# EasyEDA Pro project 作业2.eprj

# Schematic Schematic1
Board Name: Board1; Create Date: 2025-07-04; Page Name: P1; Project Name: 作业2; Schematic Name: Schematic1; Update Date: 2025-07-04; Company: 嘉立创EDA; Page Size: A4; Version: V1.0
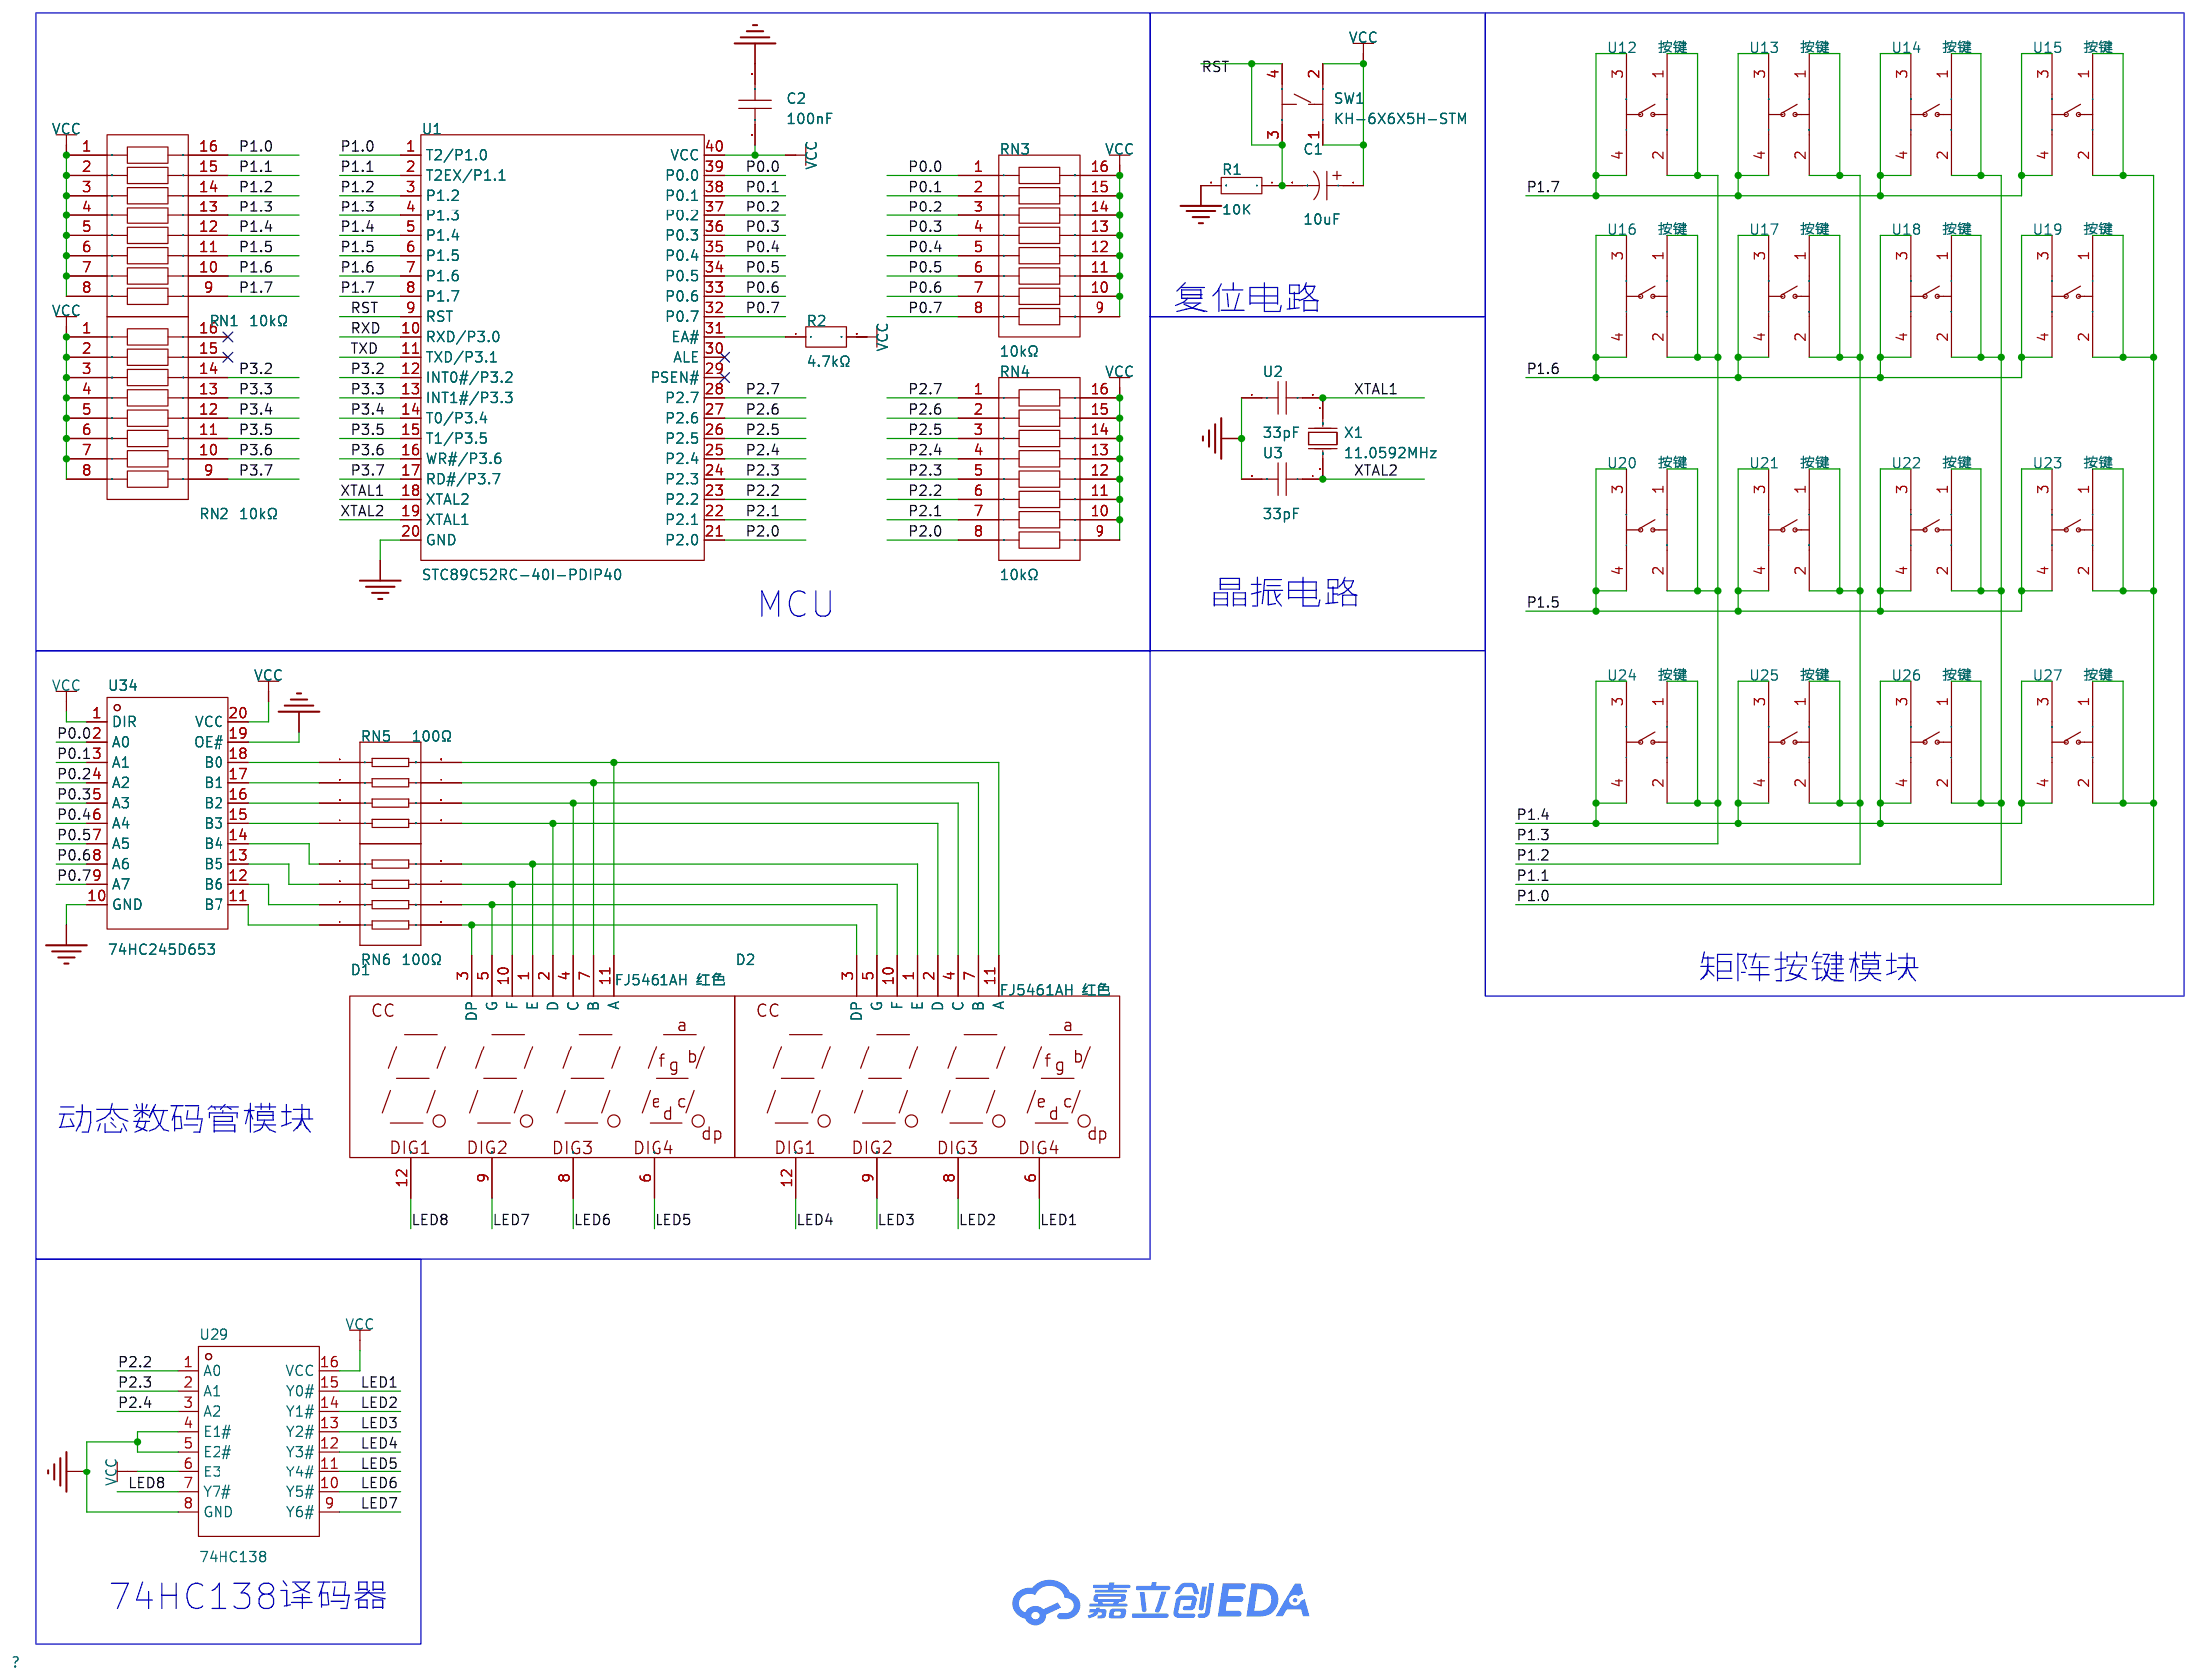
[diagram p0: schematic sheet]

## Parts
C1  10uF  [CAP-TH_BD10.0-P5.00-D0.6-FD_1]
C2  100nF  [C0603]
D1  FJ5461AH 红色  [LED-SEG-TH_FJ5461AH]
D2  FJ5461AH 红色  [LED-SEG-TH_FJ5461AH]
R1  10K  [R0603]
R2  4.7kΩ  [R0805]
RN1  10kΩ  [DIP-16_L22.0-W6.7-P2.54-LS7.6-BL]
RN2  10kΩ  [DIP-16_L22.0-W6.7-P2.54-LS7.6-BL]
RN3  10kΩ  [DIP-16_L22.0-W6.7-P2.54-LS7.6-BL]
RN4  10kΩ  [DIP-16_L22.0-W6.7-P2.54-LS7.6-BL]
RN5  100Ω  [RES-ARRAY-SMD_0402-8P-L2.0-W1.0-BL]
RN6  100Ω  [RES-ARRAY-SMD_0402-8P-L2.0-W1.0-BL]
SW1  KH-6X6X5H-STM  [SW-SMD_4P-L6.0-W6.0-P4.50-LS9.0_H5.0]
U1  STC89C52RC-40I-PDIP40  [DIP-40_L52.0-W13.7-P2.54-LS15.2-BL]
U2  33pF  [C0603]
U3  33pF  [C0603]
U12  按键  [SW-SMD_4P-L6.0-W6.0-P4.50-LS9.0-2]
U13  按键  [SW-SMD_4P-L6.0-W6.0-P4.50-LS9.0-2]
U14  按键  [SW-SMD_4P-L6.0-W6.0-P4.50-LS9.0-2]
U15  按键  [SW-SMD_4P-L6.0-W6.0-P4.50-LS9.0-2]
U16  按键  [SW-SMD_4P-L6.0-W6.0-P4.50-LS9.0-2]
U17  按键  [SW-SMD_4P-L6.0-W6.0-P4.50-LS9.0-2]
U18  按键  [SW-SMD_4P-L6.0-W6.0-P4.50-LS9.0-2]
U19  按键  [SW-SMD_4P-L6.0-W6.0-P4.50-LS9.0-2]
U20  按键  [SW-SMD_4P-L6.0-W6.0-P4.50-LS9.0-2]
U21  按键  [SW-SMD_4P-L6.0-W6.0-P4.50-LS9.0-2]
U22  按键  [SW-SMD_4P-L6.0-W6.0-P4.50-LS9.0-2]
U23  按键  [SW-SMD_4P-L6.0-W6.0-P4.50-LS9.0-2]
U24  按键  [SW-SMD_4P-L6.0-W6.0-P4.50-LS9.0-2]
U25  按键  [SW-SMD_4P-L6.0-W6.0-P4.50-LS9.0-2]
U26  按键  [SW-SMD_4P-L6.0-W6.0-P4.50-LS9.0-2]
U27  按键  [SW-SMD_4P-L6.0-W6.0-P4.50-LS9.0-2]
U29  74HC138  [SOIC-16_L9.9-W3.9-P1.27-LS6.0-BL]
U34  74HC245D653  [SOIC-20_L13.0-W7.6-P1.27-LS10.3-BL]
X1  11.0592MHz  [HC-49US_L11.5-W4.5-P4.88]

## Library data of the parts
C1 = CV100MPA16B: 容值:10uF;精度:±20%;额定电压:450V;纹波电流:200mA@100kHz;等效串联电阻(ESR):9Ω@100kHz;; LCSC Part Name: 10uF ±20% 450V; Supplier Part: C911241; Manufacturer: TWBOR(伯鸿); Supplier Footprint: 插件,D10xL16mm; JLCPCB Part Class: 扩展库; Datasheet: https://atta.szlcsc.com/upload/public/pdf/source/20201117/C911241_08C53D140102C9DE5D4425A5E1B3FE4F.pdf; Supplier: LCSC; Tolerance: ±20%; Voltage Rating: 450V; Ripple Current: 200mA@100kHz; Equivalent Series Resistance(ESR): 9Ω@100kHz; Pin Spacing: 5mm; Diameter: 10mm; Height - Seated (Max): 16mm; Lifetime: 5000hrs@105℃; Operating Temperature: -25℃~+105℃
C2 = 0603X7R104K250NT: 容值:100nF;精度:±10%;额定电压:25V;温度系数:X7R;; LCSC Part Name: 100nF ±10% 25V; Supplier Part: C48579280; Manufacturer: AIDE(爱迪电容); Supplier Footprint: 0603; JLCPCB Part Class: 扩展库; Datasheet: https://atta.szlcsc.com/upload/public/pdf/source/20210330/C2691711_5D01E1D4D7BF54205139C8425089DFE9.pdf; Supplier: LCSC; Tolerance: ±10%; Voltage Rating: 25V; Temperature Coefficient: X7R
D1 D2 = FJ5461AH 红色: 数码管位数:4位;功耗:-;发光颜色:红色;LED极性:共阴极;数字/字母大小(英寸):0.56;; LCSC Part Name: 4位0.56英寸红色数码管 共阴极; Supplier Part: C54396; Manufacturer: 志浩; Supplier Footprint: 插件; JLCPCB Part Class: 扩展库; Datasheet: https://atta.szlcsc.com/upload/public/pdf/source/20151111/1457707576636.pdf; Supplier: LCSC; Number of Characters: 4位; Display Type: 7段; Luminous Color: 红色; LED Polarity: 共阴极; Digit/Alpha Size(inch): 0.56
R1 = Res_0603: Supplier Footprint: 0603
R2 = ERJ-U06F4701V: 电阻类型:厚膜电阻;阻值:4.7kΩ;精度:±1%;功率:125mW;工作电压:-;温度系数:±100ppm/℃;; LCSC Part Name: 4.7kΩ ±1% 125mW 厚膜电阻; Supplier Part: C1859462; Manufacturer: PANASONIC(松下); Supplier Footprint: 0805; JLCPCB Part Class: 扩展库; Datasheet: https://atta.szlcsc.com/upload/public/pdf/source/20210624/C1859462_0DC8A541405FCF91B34CFE3F505433C6.pdf; Supplier: LCSC; Type: 厚膜电阻; Tolerance: ±1%; Power(Watts): 125mW; Temperature Coefficient: ±100ppm/℃; Operating Temperature: -55℃~+155℃
RN1-RN4 = 4116R-1-103LF: 电阻器数:8;阻值:10kΩ;精度:±2%;单个元件功率:250mW;温度系数:±100ppm/℃;; LCSC Part Name: 10kΩ ±2%; Supplier Part: C6087381; Manufacturer: BOURNS; Supplier Footprint: DIP-16; Datasheet: https://atta.szlcsc.com/upload/public/pdf/source/20210630/3D9C012B231BA1D1C9C6139B97130D1A.pdf; Supplier: LCSC; Number of Resistors: 8; Tolerance: ±2%; Power(Watts): 250mW; Temperature Coefficient: ±100ppm/℃; Number of Pins: 16
RN5 RN6 = 4D02WGJ0101TCE: 电阻器数:4;阻值:100Ω;精度:±5%;单个元件功率:62.5mW;温度系数:±200ppm/℃;; LCSC Part Name: 100Ω ±5%; Supplier Part: C48442; Manufacturer: UNI-ROYAL(厚声); Supplier Footprint: 0402x4; JLCPCB Part Class: 扩展库; Datasheet: https://atta.szlcsc.com/upload/public/pdf/source/20191224/C474318_2527498AE30E813171187CCD28401A71.pdf; Supplier: LCSC; Number of Resistors: 4; Tolerance: ±5%; Power(Watts): 62.5mW; Temperature Coefficient: ±200ppm/℃; Number of Pins: 8
SW1 = KH-6X6X5H-STM: 电路结构:单刀单掷;按钮形状:圆形按钮;安装方式:立贴;开关长度:6mm;开关宽度:6mm;开关高度:5mm;带支架:不带;触点电流:50mA;额定电压(DC):12V;机械寿命:8万次;; LCSC Part Name: 6*6*5mm 立贴 轻触开关; Supplier Part: C2837531; Manufacturer: kinghelm(金航标); Supplier Footprint: SMD; JLCPCB Part Class: 扩展库; Datasheet: https://atta.szlcsc.com/upload/public/pdf/source/20210608/C2837531_45E87AB996CE723B09405FF2EA209C4C.pdf; Supplier: LCSC; Circuit: 单刀单掷; Actuator Style: 圆形按钮; Mounting Style: 立贴; Switch Length: 6mm; Switch Width: 6mm; Switch Height: 5mm; Strike Gundam: 不带; Contact Current: 50mA; Voltage Rating (DC): 12V; Actuator/Cap Color: 黑色; Pin Style: 鸥翼型; Mechanical Life: 8万次
U1 = STC89C52RC-40I-PDIP40: CPU内核:51系列;应用领域:-;; Supplier Part: C14022; Manufacturer: STC; Supplier Footprint: DIP-40; JLCPCB Part Class: 扩展库; Datasheet: https://atta.szlcsc.com/upload/public/pdf/source/20250219/C2F0DDDE7C5E9ADA5B33742D18630F09.pdf; Supplier: LCSC; CPU Core: 51系列; Program Storage Size: 8KB; Program Memory Type: FLASH; Number of I/O: 35; Voltage - Supply: 3.3V~5.5V
U2 U3 = GRM1885C1H330FA01D: 容值:33pF;精度:±1%;额定电压:50V;温度系数:-;; LCSC Part Name: 33pF ±1% 50V; Supplier Part: C882522; Manufacturer: muRata(村田); Supplier Footprint: 0603; JLCPCB Part Class: 扩展库; Datasheet: https://atta.szlcsc.com/upload/public/pdf/source/20200305/C490387_23319AE8C154DEB24C505E6C82A8106A.pdf; Supplier: LCSC; Tolerance: ±1%; Voltage Rating: 50V
U12-U27 = 按键: Supplier Part: C9900024939; Supplier Footprint: SW-SMD; JLCPCB Part Class: 扩展库; Supplier: LCSC
U29 = 74HC138: 三八译码器，74系列逻辑芯片,2.0V-6.0V供电电压。; LCSC Part Name: 停产; Supplier Part: C86611; Manufacturer: FM(富满); Supplier Footprint: SOIC-16; JLCPCB Part Class: 扩展库; Datasheet: https://atta.szlcsc.com/upload/public/pdf/source/20170103/1483435332227.pdf; Supplier: LCSC
U34 = 74HC245D653: Supplier Part: C70245; Supplier Footprint: SOIC-20-300mil; JLCPCB Part Class: 扩展库; Supplier: LCSC
X1 = X49SD110592MSD2SC: 晶振类型:直插晶振;频率:11.0592MHz;常温频差:±20ppm;负载电容:20pF;频率稳定度:±30ppm;; LCSC Part Name: HC-49US 11.0592MHZ 2P 49S 20PF ±20PPM -20~70℃（±30PPM）; Supplier Part: C2203; Manufacturer: YXC(扬兴晶振); Supplier Footprint: HC-49S; JLCPCB Part Class: 扩展库; Datasheet: https://atta.szlcsc.com/upload/public/pdf/source/20240329/977D7F2434F98B2BE33270BB9FF3D86D.pdf; Supplier: LCSC; Type: 直插晶振; Normal temperature Frequency Tolerance: ±20ppm; Load Capacitance: 20pF; Frequency Stability: ±30ppm; Operating Temperature: -20℃~+70℃

## Nets
GND: C2.2 R1.2 U1.20(GND) U2.1 U3.2 U29.4(E1#) U29.5(E2#) U29.8(GND) U34.10(GND) U34.19(OE#)
VCC: C1.1 C2.1 R2.2 RN1.1 RN1.2 RN1.3 RN1.4 RN1.5 RN1.6 RN1.7 RN1.8 RN2.1 RN2.2 RN2.3 RN2.4 RN2.5 RN2.6 RN2.7 RN2.8 RN3.9 RN3.10 RN3.11 RN3.12 RN3.13 RN3.14 RN3.15 RN3.16 RN4.9 RN4.10 RN4.11 RN4.12 RN4.13 RN4.14 RN4.15 RN4.16 SW1.1 SW1.2 U1.40(VCC) U29.6(E3) U29.16(VCC) U34.1(DIR) U34.20(VCC)
LED1: D2.6(DIG4) U29.15(Y0#)
LED2: D2.8(DIG3) U29.14(Y1#)
LED3: D2.9(DIG2) U29.13(Y2#)
LED4: D2.12(DIG1) U29.12(Y3#)
LED5: D1.6(DIG4) U29.11(Y4#)
LED6: D1.8(DIG3) U29.10(Y5#)
LED7: D1.9(DIG2) U29.9(Y6#)
LED8: D1.12(DIG1) U29.7(Y7#)
P0.0: RN3.1 U1.39(P0.0) U34.2(A0)
P0.1: RN3.2 U1.38(P0.1) U34.3(A1)
P0.2: RN3.3 U1.37(P0.2) U34.4(A2)
P0.3: RN3.4 U1.36(P0.3) U34.5(A3)
P0.4: RN3.5 U1.35(P0.4) U34.6(A4)
P0.5: RN3.6 U1.34(P0.5) U34.7(A5)
P0.6: RN3.7 U1.33(P0.6) U34.8(A6)
P0.7: RN3.8 U1.32(P0.7) U34.9(A7)
P1.0: RN1.16 U1.1(T2/P1.0) U15.1 U15.2 U19.1 U19.2 U23.1 U23.2 U27.1 U27.2
P1.1: RN1.15 U1.2(T2EX/P1.1) U14.1 U14.2 U18.1 U18.2 U22.1 U22.2 U26.1 U26.2
P1.2: RN1.14 U1.3(P1.2) U13.1 U13.2 U17.1 U17.2 U21.1 U21.2 U25.1 U25.2
P1.3: RN1.13 U1.4(P1.3) U12.1 U12.2 U16.1 U16.2 U20.1 U20.2 U24.1 U24.2
P1.4: RN1.12 U1.5(P1.4) U24.3 U24.4 U25.3 U25.4 U26.3 U26.4 U27.3 U27.4
P1.5: RN1.11 U1.6(P1.5) U20.3 U20.4 U21.3 U21.4 U22.3 U22.4 U23.3 U23.4
P1.6: RN1.10 U1.7(P1.6) U16.3 U16.4 U17.3 U17.4 U18.3 U18.4 U19.3 U19.4
P1.7: RN1.9 U1.8(P1.7) U12.3 U12.4 U13.3 U13.4 U14.3 U14.4 U15.3 U15.4
P2.0: RN4.8 U1.21(P2.0)
P2.1: RN4.7 U1.22(P2.1)
P2.2: RN4.6 U1.23(P2.2) U29.1(A0)
P2.3: RN4.5 U1.24(P2.3) U29.2(A1)
P2.4: RN4.4 U1.25(P2.4) U29.3(A2)
P2.5: RN4.3 U1.26(P2.5)
P2.6: RN4.2 U1.27(P2.6)
P2.7: RN4.1 U1.28(P2.7)
P3.2: RN2.14 U1.12(INT0#/P3.2)
P3.3: RN2.13 U1.13(INT1#/P3.3)
P3.4: RN2.12 U1.14(T0/P3.4)
P3.5: RN2.11 U1.15(T1/P3.5)
P3.6: RN2.10 U1.16(WR#/P3.6)
P3.7: RN2.9 U1.17(RD#/P3.7)
RST: C1.2 R1.1 SW1.3 SW1.4 U1.9(RST)
RXD: U1.10(RXD/P3.0)
TXD: U1.11(TXD/P3.1)
XTAL1: U1.18(XTAL2) U2.2 X1.1(OSC1)
XTAL2: U1.19(XTAL1) U3.1 X1.2(OSC2)
$1N691: R2.1 U1.31(EA#)
$1N1499: RN5.1 U34.18(B0)
$1N1500: RN5.2 U34.17(B1)
$1N1501: RN5.3 U34.16(B2)
$1N1502: RN5.4 U34.15(B3)
$1N1503: RN6.1 U34.14(B4)
$1N1504: RN6.2 U34.13(B5)
$1N1505: RN6.3 U34.12(B6)
$1N1506: RN6.4 U34.11(B7)
$1N1507: D1.11(A) D2.11(A) RN5.8
$1N1508: D1.7(B) D2.7(B) RN5.7
$1N1509: D1.4(C) D2.4(C) RN5.6
$1N1510: D1.2(D) D2.2(D) RN5.5
$1N1511: D1.1(E) D2.1(E) RN6.8
$1N1512: D1.10(F) D2.10(F) RN6.7
$1N1513: D1.5(G) D2.5(G) RN6.6
$1N1514: D1.3(DP) D2.3(DP) RN6.5

Not connected (* = marked no-connect by the designer): RN2 15* 16*; U1 29(PSEN#)* 30(ALE)*

## Notes on the sheet
- 复位电路
- MCU
- 晶振电路
- 矩阵按键模块
- 动态数码管模块
- 74HC138译码器

# Board PCB1
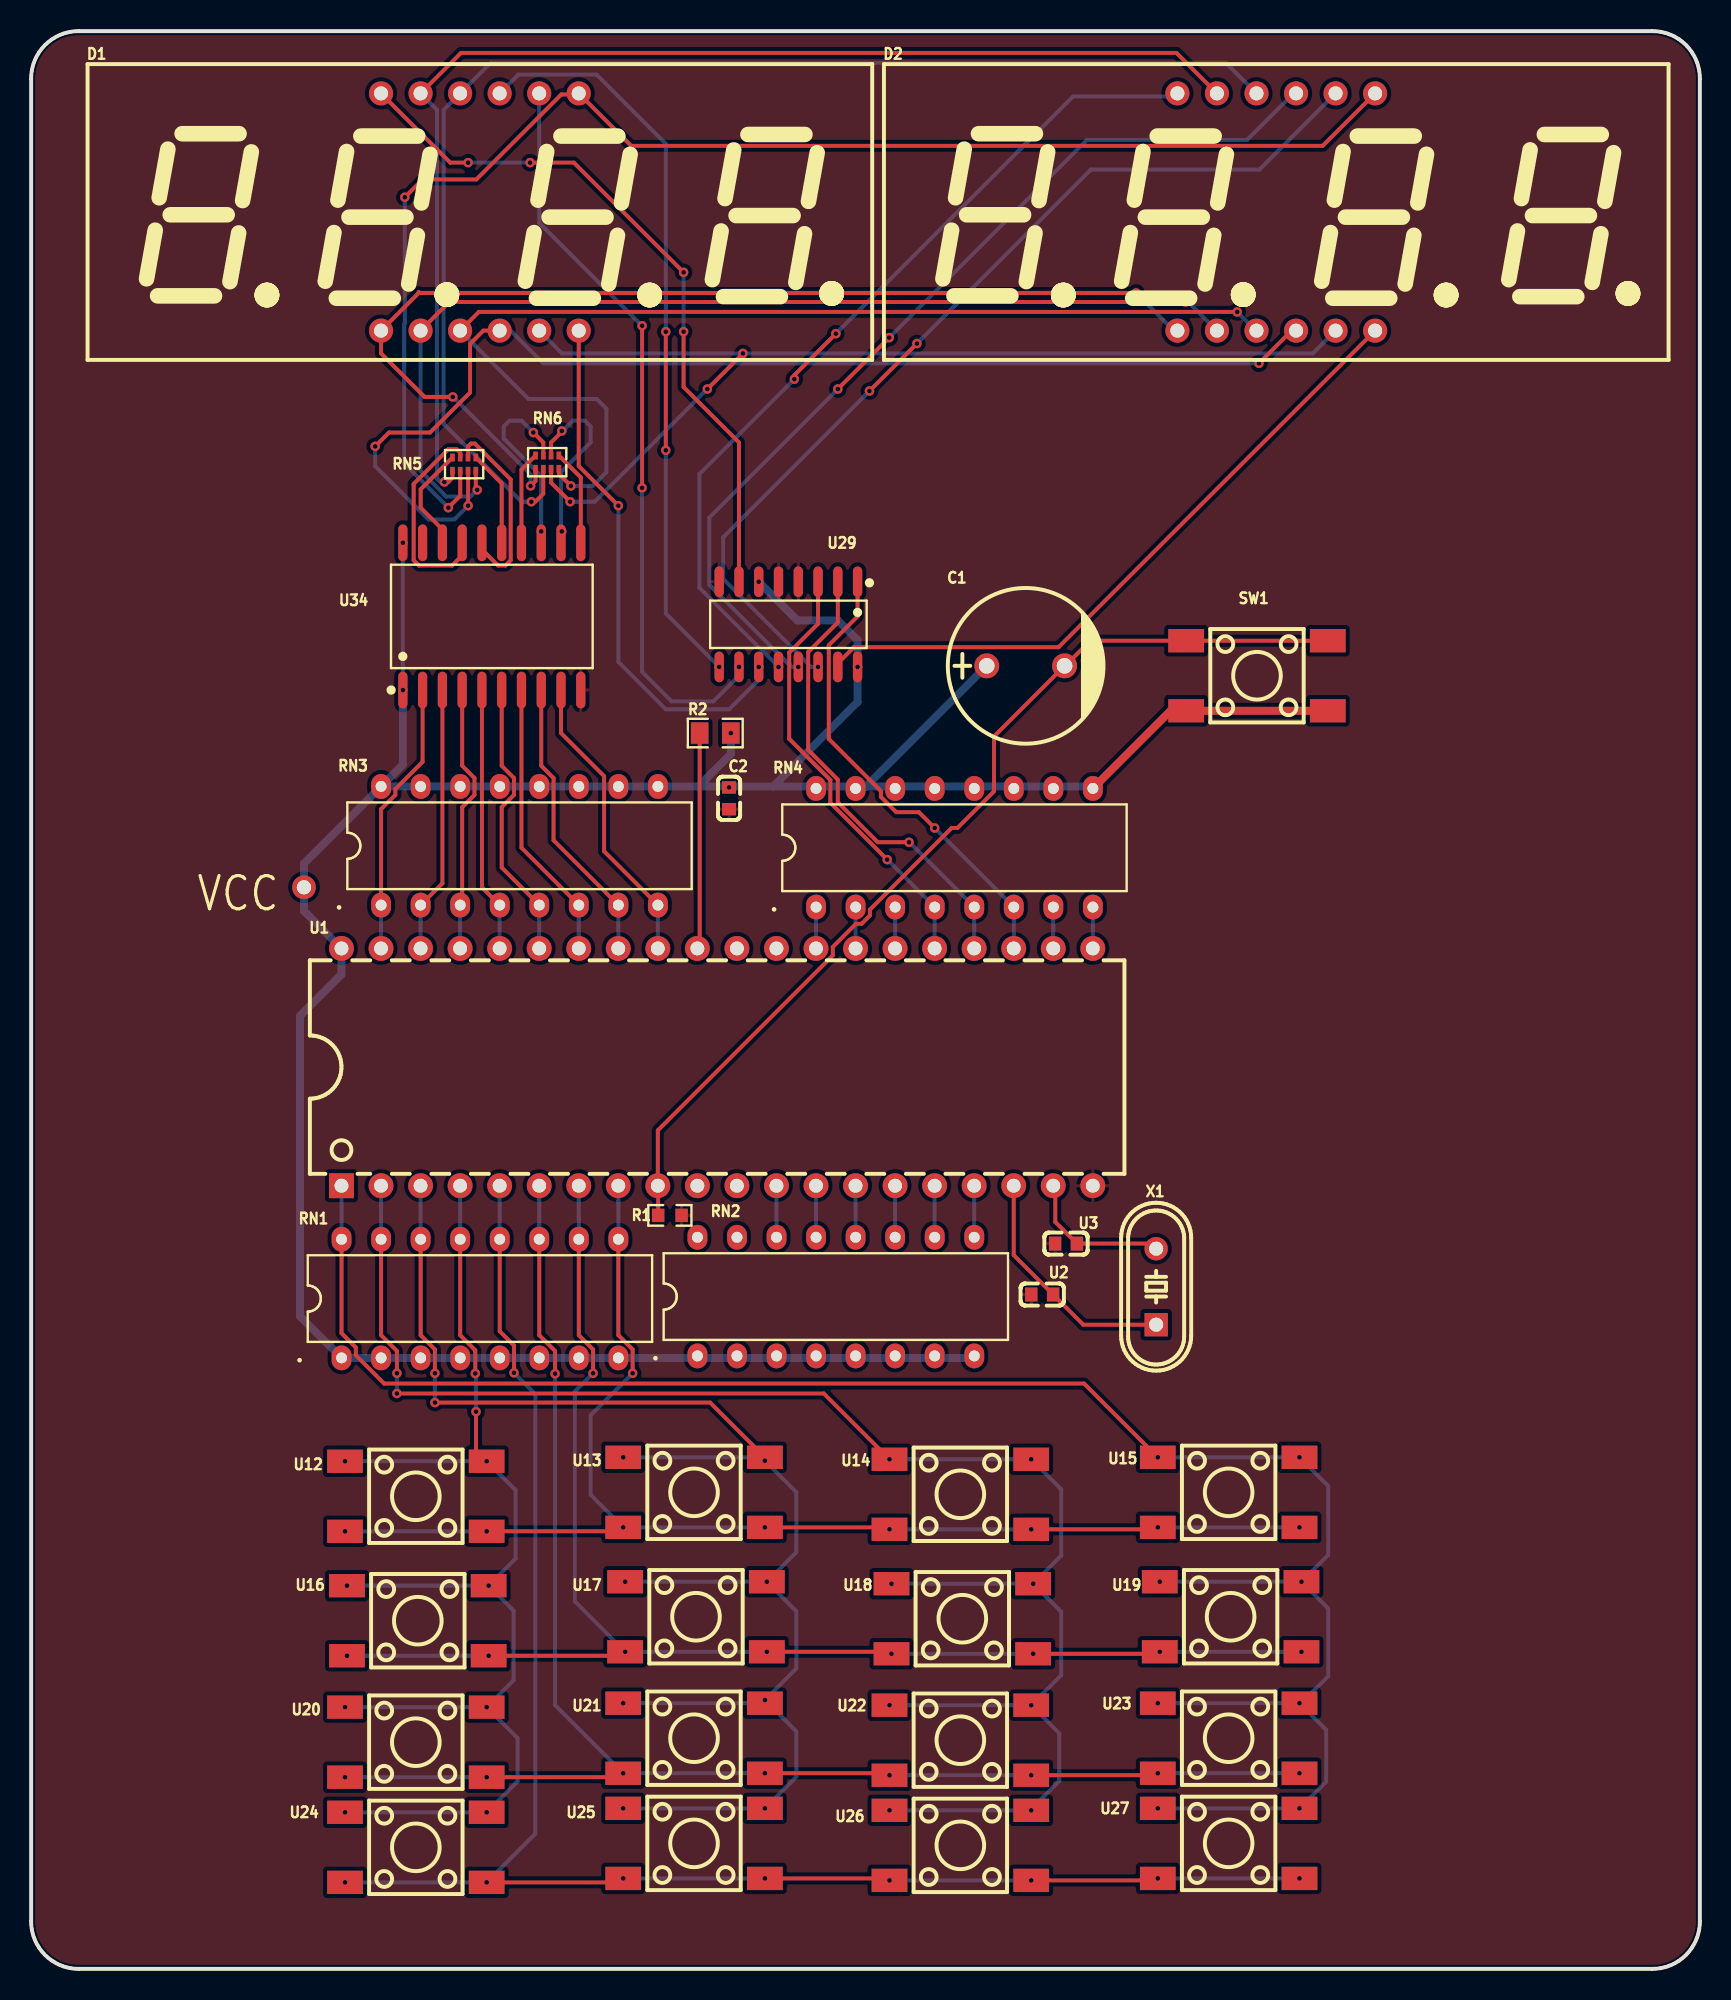
[diagram p1: board, top side]
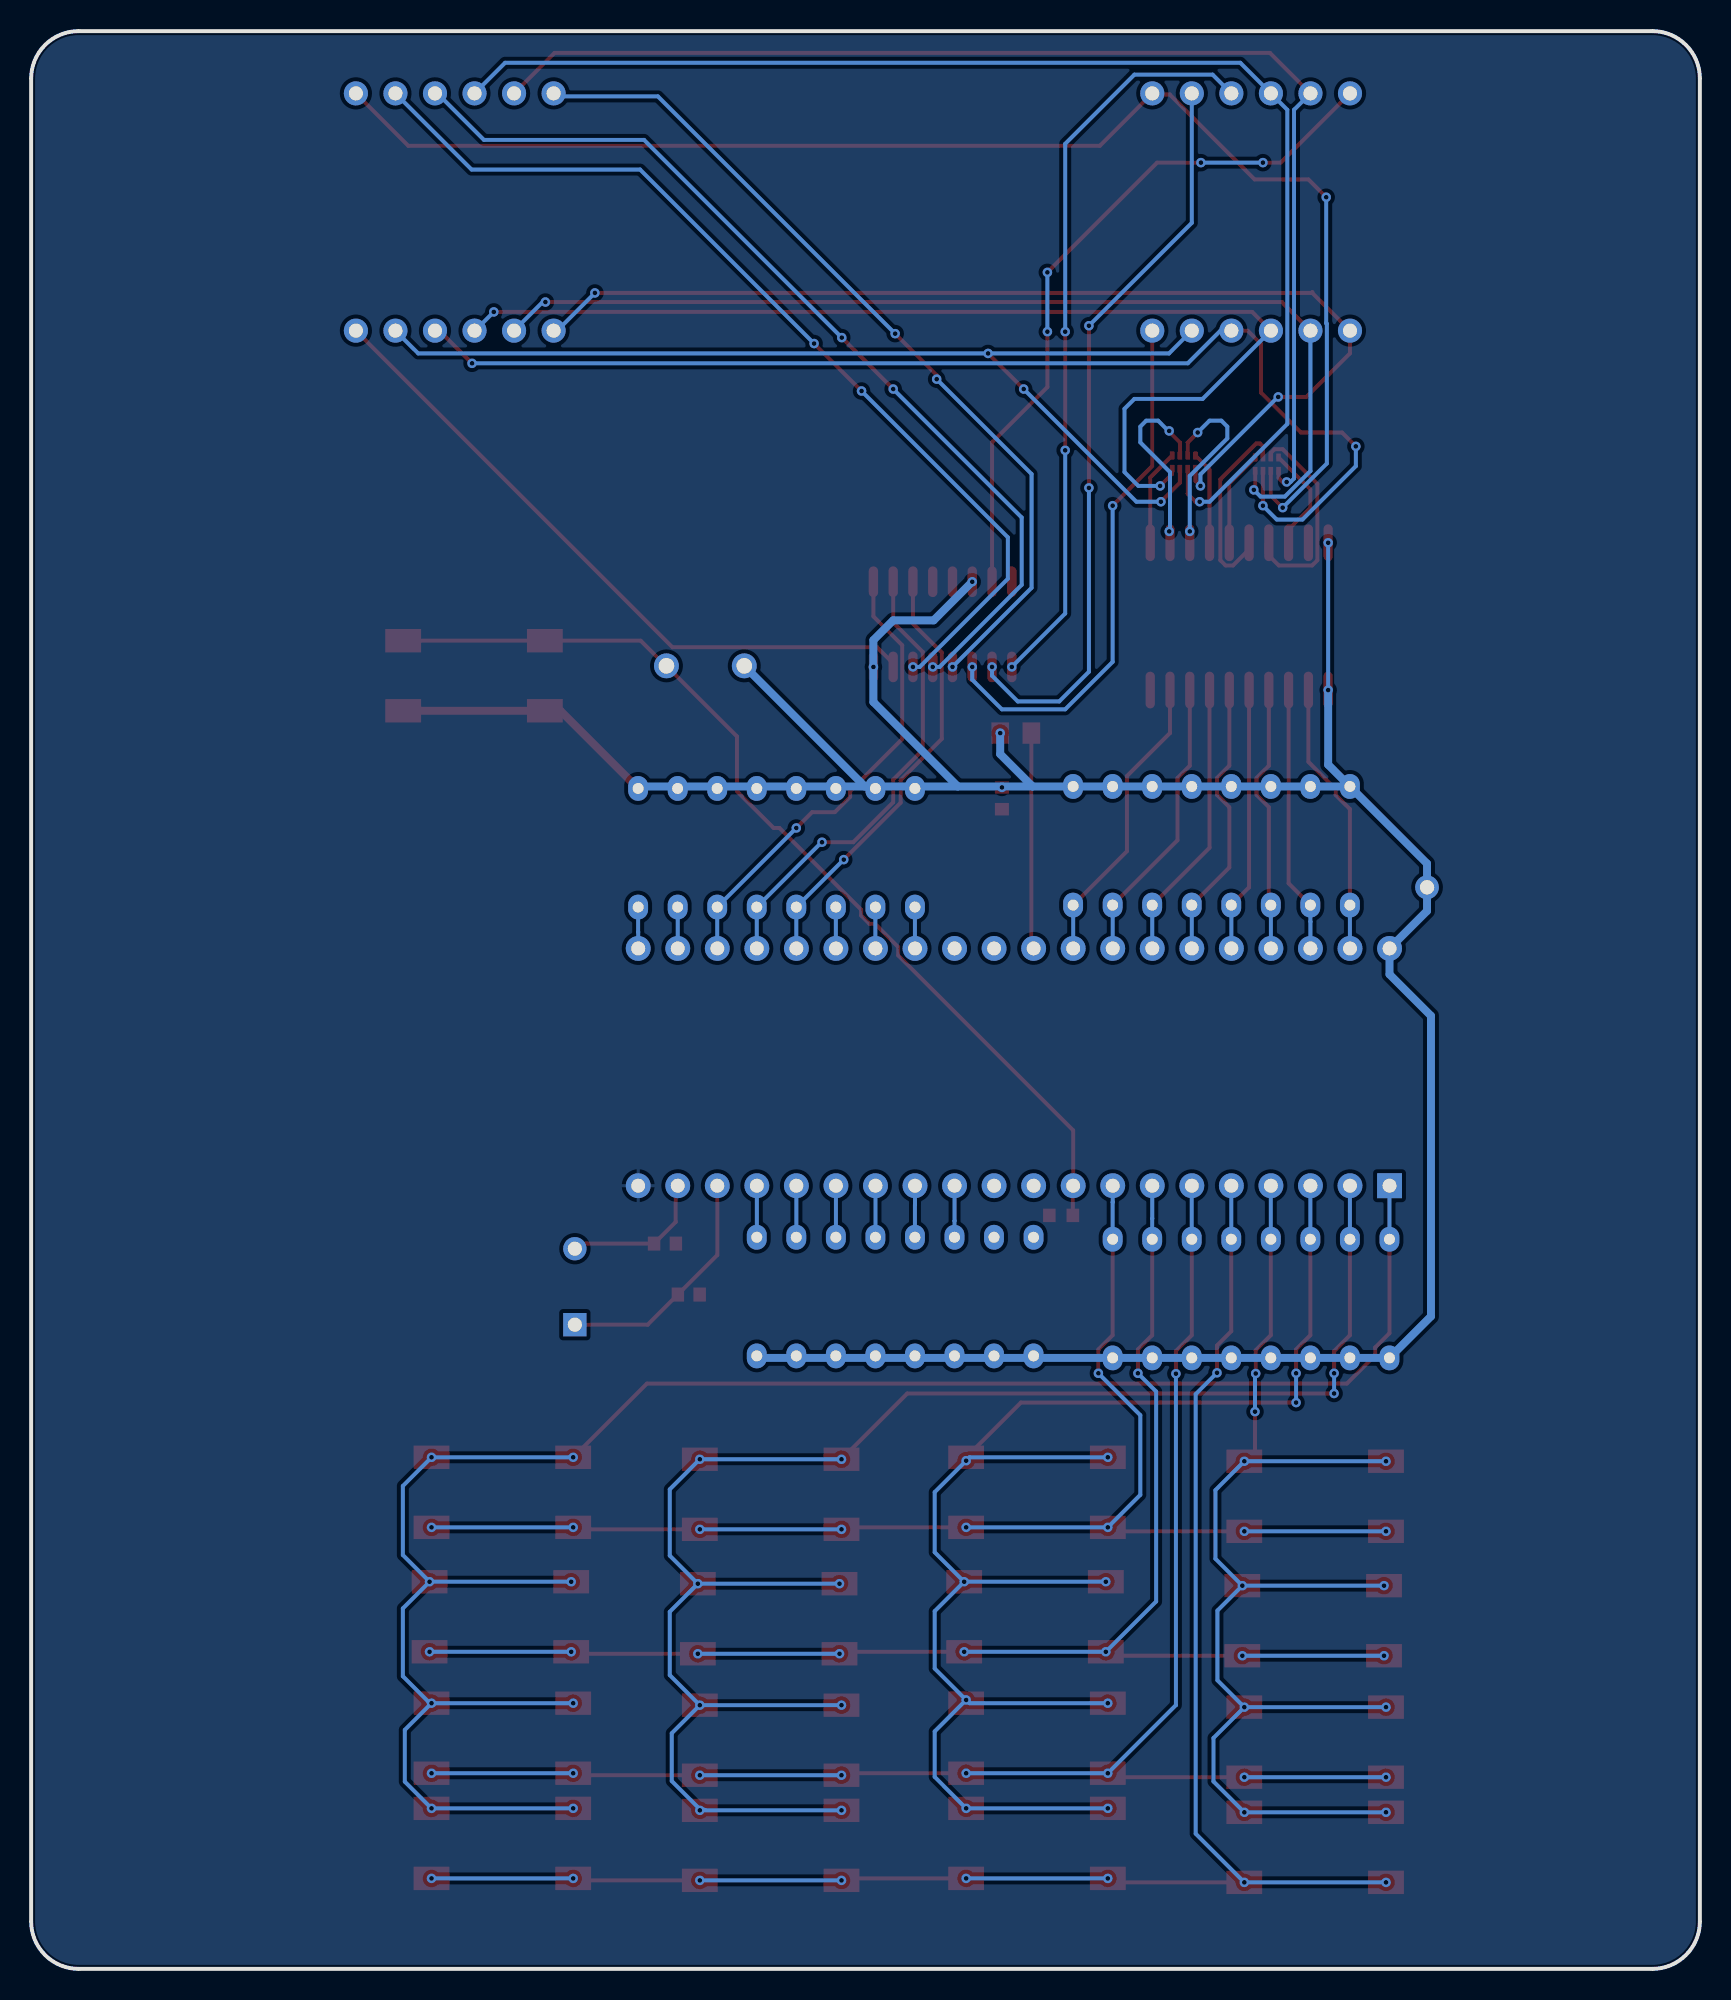
[diagram p2: board, bottom side, seen from below]

Outline 107.19 x 124.46 mm; copper layers: Top Layer, Bottom Layer. Coordinates in mm from the lower left corner of the outline.
Outline path: 0,121.41 0,3.05 arc(0.89,0.89) 3.05,0 104.14,0 arc(106.3,0.89) 107.19,3.05 107.19,121.41 arc(106.3,123.57) 104.14,124.46 3.05,124.46 arc(0.89,123.57) 0,121.41
Stack: Top Layer 0.035mm / Dielectric1 1.51mm FR4 er 4.5 / Bottom Layer 0.035mm

## Design rules (mm)
template: JLCPCB Capability(Two Layers Board)
spacing copperThickness1oz (default): track to track 0.102, other pairs 0.152 to 0.3
spacing copperThickness2oz: track to track 0.203, other pairs 0.152 to 0.3
track width copperThickness1oz (default): min 0.127, default 0.254, max 2.54
track width copperThickness2oz: min 0.203, default 0.254, max 2.54
differential pair differentialPair (default): width min 0.127, default 0.254, max 2.54; gap min 0.152, default 0.152
via viaSize (default): diameter min 0.5, default 0.61, max 10; hole min 0.3, default 0.305, max 6.3

## Placement (name value [footprint] x y rotation side)
C1  10uF  [CAP-TH_BD10.0-P5.00-D0.6-FD_1]  63.88 83.69 0 top
C2  100nF  [C0603]  44.83 75.18 270 top
D1  FJ5461AH 红色  [LED-SEG-TH_FJ5461AH]  28.82 112.84 0 top
D2  FJ5461AH 红色  [LED-SEG-TH_FJ5461AH]  79.98 112.84 0 top
NOREF  -  [Pad_e132]  17.53 69.47 0 top
R1  10K  [R0603]  41.03 48.4 0 top
R2  4.7kΩ  [R0805]  43.94 79.37 0 top
RN1  10kΩ  [DIP-16_L22.0-W6.7-P2.54-LS7.6-BL]  28.83 43.05 0 top
RN2  10kΩ  [DIP-16_L22.0-W6.7-P2.54-LS7.6-BL]  51.69 43.18 0 top
RN3  10kΩ  [DIP-16_L22.0-W6.7-P2.54-LS7.6-BL]  31.37 72.14 0 top
RN4  10kΩ  [DIP-16_L22.0-W6.7-P2.54-LS7.6-BL]  59.31 72.01 0 top
RN5  100Ω  [RES-ARRAY-SMD_0402-8P-L2.0-W1.0-BL]  27.81 96.65 0 top
RN6  100Ω  [RES-ARRAY-SMD_0402-8P-L2.0-W1.0-BL]  33.15 96.77 0 top
SW1  KH-6X6X5H-STM  [SW-SMD_4P-L6.0-W6.0-P4.50-LS9.0_H5.0]  78.74 83.06 180 top
U1  STC89C52RC-40I-PDIP40  [DIP-40_L52.0-W13.7-P2.54-LS15.2-BL]  44.06 57.92 0 top
U2  33pF  [C0603]  64.95 43.31 0 top
U3  33pF  [C0603]  66.47 46.58 180 top
U12  按键  [SW-SMD_4P-L6.0-W6.0-P4.50-LS9.0-2]  24.71 30.35 0 top
U13  按键  [SW-SMD_4P-L6.0-W6.0-P4.50-LS9.0-2]  42.58 30.61 0 top
U14  按键  [SW-SMD_4P-L6.0-W6.0-P4.50-LS9.0-2]  59.69 30.48 0 top
U15  按键  [SW-SMD_4P-L6.0-W6.0-P4.50-LS9.0-2]  76.92 30.61 0 top
U16  按键  [SW-SMD_4P-L6.0-W6.0-P4.50-LS9.0-2]  24.84 22.36 0 top
U17  按键  [SW-SMD_4P-L6.0-W6.0-P4.50-LS9.0-2]  42.71 22.62 0 top
U18  按键  [SW-SMD_4P-L6.0-W6.0-P4.50-LS9.0-2]  59.81 22.49 0 top
U19  按键  [SW-SMD_4P-L6.0-W6.0-P4.50-LS9.0-2]  77.05 22.62 0 top
U20  按键  [SW-SMD_4P-L6.0-W6.0-P4.50-LS9.0-2]  24.71 14.56 0 top
U21  按键  [SW-SMD_4P-L6.0-W6.0-P4.50-LS9.0-2]  42.58 14.81 0 top
U22  按键  [SW-SMD_4P-L6.0-W6.0-P4.50-LS9.0-2]  59.69 14.69 0 top
U23  按键  [SW-SMD_4P-L6.0-W6.0-P4.50-LS9.0-2]  76.92 14.81 0 top
U24  按键  [SW-SMD_4P-L6.0-W6.0-P4.50-LS9.0-2]  24.71 7.81 0 top
U25  按键  [SW-SMD_4P-L6.0-W6.0-P4.50-LS9.0-2]  42.58 8.06 0 top
U26  按键  [SW-SMD_4P-L6.0-W6.0-P4.50-LS9.0-2]  59.69 7.93 0 top
U27  按键  [SW-SMD_4P-L6.0-W6.0-P4.50-LS9.0-2]  76.92 8.06 0 top
U29  74HC138  [SOIC-16_L9.9-W3.9-P1.27-LS6.0-BL]  48.64 86.36 180 top
U34  74HC245D653  [SOIC-20_L13.0-W7.6-P1.27-LS10.3-BL]  29.59 86.87 0 top
X1  11.0592MHz  [HC-49US_L11.5-W4.5-P4.88]  72.26 43.81 90 top

## Footprints (pads in the part's own frame, mm; a bottom-side part is the same pattern mirrored in y, then rotated)
C0603
  rect 0.8x0.9 smd: 1(-0.7,0) 2(0.7,0)
CAP-TH_BD10.0-P5.00-D0.6-FD_1
  round 1.6 hole 1: 1(-2.5,0) 2(2.5,0)
DIP-16_L22.0-W6.7-P2.54-LS7.6-BL
  oval 1.276x1.595 hole 0.7: 1(-8.89,-3.81) 2(-6.35,-3.81) 3(-3.81,-3.81) 4(-1.27,-3.81) 5(1.27,-3.81) 6(3.81,-3.81) 7(6.35,-3.81) 8(8.89,-3.81) 9(8.89,3.81) 10(6.35,3.81) 11(3.81,3.81) 12(1.27,3.81) 13(-1.27,3.81) 14(-3.81,3.81) 15(-6.35,3.81) 16(-8.89,3.81)
DIP-40_L52.0-W13.7-P2.54-LS15.2-BL
  rect 1.6x1.6 hole 0.889: 1(-24.13,-7.62)
  round 1.6 hole 0.889: 2(-21.59,-7.62) 3(-19.05,-7.62) 4(-16.51,-7.62) 5(-13.97,-7.62) 6(-11.43,-7.62) 7(-8.89,-7.62) 8(-6.35,-7.62) 9(-3.81,-7.62) 10(-1.27,-7.62) 11(1.27,-7.62) 12(3.81,-7.62) 13(6.35,-7.62) 14(8.89,-7.62) 15(11.43,-7.62) 16(13.97,-7.62) 17(16.51,-7.62) 18(19.05,-7.62) 19(21.59,-7.62) 20(24.13,-7.62) 21(24.13,7.62) 22(21.59,7.62) 23(19.05,7.62) 24(16.51,7.62) 25(13.97,7.62) 26(11.43,7.62) 27(8.89,7.62) 28(6.35,7.62) 29(3.81,7.62) 30(1.27,7.62) 31(-1.27,7.62) 32(-3.81,7.62) 33(-6.35,7.62) 34(-8.89,7.62) 35(-11.43,7.62) 36(-13.97,7.62) 37(-16.51,7.62) 38(-19.05,7.62) 39(-21.59,7.62) 40(-24.13,7.62)
HC-49US_L11.5-W4.5-P4.88
  rect 1.5x1.5 hole 0.9: 1(-2.44,0)
  round 1.5 hole 0.9: 2(2.44,0)
LED-SEG-TH_FJ5461AH
  round 1.55 hole 0.9: 1(-6.35,-7.62) 2(-3.81,-7.62) 3(-1.27,-7.62) 4(1.27,-7.62) 5(3.81,-7.62) 6(6.35,-7.62) 7(6.35,7.62) 8(3.81,7.62) 9(1.27,7.62) 10(-1.27,7.62) 11(-3.81,7.62) 12(-6.35,7.62)
Pad_e132
  round 1.524 hole 0.914: 1(0,0)
R0603
  rect 0.806x0.864 smd: 1(-0.753,0) 2(0.753,0)
R0805
  rect 1.133x1.377 smd: 1(-1,0) 2(1,0)
RES-ARRAY-SMD_0402-8P-L2.0-W1.0-BL
  rect 0.3x0.505 smd: 1(-0.75,0.427) 2(-0.25,0.427) 3(0.25,0.427) 4(0.75,0.427) 5(0.75,-0.427) 6(0.25,-0.427) 7(-0.25,-0.427) 8(-0.75,-0.427)
SOIC-16_L9.9-W3.9-P1.27-LS6.0-BL
  oval 0.602x1.971 smd: 1(-4.445,-2.736) 2(-3.175,-2.736) 3(-1.905,-2.736) 4(-0.635,-2.736) 5(0.635,-2.736) 6(1.905,-2.736) 7(3.175,-2.736) 8(4.445,-2.736) 9(4.445,2.736) 10(3.175,2.736) 11(1.905,2.736) 12(0.635,2.736) 13(-0.635,2.736) 14(-1.905,2.736) 15(-3.175,2.736) 16(-4.445,2.736)
SOIC-20_L13.0-W7.6-P1.27-LS10.3-BL
  oval 0.595x2.36 smd: 1(-5.715,-4.73) 2(-4.445,-4.73) 3(-3.175,-4.73) 4(-1.905,-4.73) 5(-0.635,-4.73) 6(0.635,-4.73) 7(1.905,-4.73) 8(3.175,-4.73) 9(4.445,-4.73) 10(5.715,-4.73) 11(5.715,4.73) 12(4.445,4.73) 13(3.175,4.73) 14(1.905,4.73) 15(0.635,4.73) 16(-0.635,4.73) 17(-1.905,4.73) 18(-3.175,4.73) 19(-4.445,4.73) 20(-5.715,4.73)
SW-SMD_4P-L6.0-W6.0-P4.50-LS9.0-2
  rect 2.3x1.5 smd: 1(-4.55,2.25) 2(4.55,2.25) 3(-4.55,-2.25) 4(4.55,-2.25)
SW-SMD_4P-L6.0-W6.0-P4.50-LS9.0_H5.0
  rect 2.3x1.5 smd: 1(-4.55,2.25) 2(4.55,2.25) 3(-4.55,-2.25) 4(4.55,-2.25)

## Nets
As in the schematic, except:
VCC: C1.1 C2.1 NOREF.1 R2.2 RN1.1 RN1.2 RN1.3 RN1.4 RN1.5 RN1.6 RN1.7 RN1.8 RN2.1 RN2.2 RN2.3 RN2.4 RN2.5 RN2.6 RN2.7 RN2.8 RN3.9 RN3.10 RN3.11 RN3.12 RN3.13 RN3.14 RN3.15 RN3.16 RN4.9 RN4.10 RN4.11 RN4.12 RN4.13 RN4.14 RN4.15 RN4.16 SW1.1 SW1.2 U1.40 U29.6 U29.16 U34.1 U34.20

Pads without a net: RN2 15 16; U1 29 30

## Via types
v1: diameter 0.61, hole 0.305, Top Layer to Bottom Layer, 125 vias

## Routing (per net, layer and track width the routed paths; a pad name or vN(x,y) marks a point on that pad's centre or on a via; arc(x,y) is an arc through that point)
VCC: length 196.8
  Top Layer w0.508: RN4.9 73.19,80.81 SW1.2 83.29,80.81
  Bottom Layer w0.254: v1(23.88,82.14) v1(23.88,91.6)
  Bottom Layer w0.508: 47.66,75.95 53.09,75.95 ; 47.66,75.95 42.86,75.95 ; 47.66,75.95 53.09,81.37 v1(53.09,83.62) 53.09,85.34 51.82,86.61 49.22,86.61 v1(46.74,89.1) ; 53.09,75.95 RN4.15 ; 53.09,75.95 53.63,75.95 ; RN2.8 60.45,39.24 RN1.8 RN1.7 RN1.6 RN1.5 RN1.4 RN1.3 RN1.2 RN1.1 17.27,41.91 17.27,61.21 19.93,63.88 U1.40 17.53,67.95 17.53,70.99 RN3.16 ; 42.86,75.95 44.94,78.03 v1(44.94,79.37) ; 42.86,75.95 RN3.9 RN3.10 RN3.11 RN3.12 RN3.13 RN3.14 RN3.15 RN3.16 ; RN3.16 23.88,77.34 v1(23.88,82.14) ; RN4.9 68.07,75.95 53.63,75.95 ; 53.63,75.95 C1.1
  vias: v1(44.83,75.88)
LED1: length 43.6
  Top Layer w0.254: U29.15 51.82,83.86 52.85,84.89 65.99,84.89 D2.6
LED2: length 62.3
  Top Layer w0.254: v1(53.85,101.35) v1(56.9,104.39)
  Bottom Layer w0.254: v1(56.9,104.39) 68.07,115.57 78.9,115.57 D2.8 ; v1(50.55,83.62) 50.11,83.62 44.45,89.29 44.45,91.95 v1(53.85,101.35)
LED3: length 61.2
  Top Layer w0.254: v1(51.82,101.47) v1(55.12,104.77)
  Bottom Layer w0.254: 81.25,120.46 81.09,120.46 78.1,117.47 67.82,117.47 v1(55.12,104.77) ; v1(49.28,83.62) 48.83,83.62 43.56,88.9 43.56,93.22 v1(51.82,101.47)
LED4: length 55.5
  Top Layer w0.254: v1(49.02,102.11) 49.02,102.36 v1(51.69,105.03)
  Bottom Layer w0.254: D2.12 73.43,120.27 66.93,120.27 v1(51.69,105.03) ; v1(48.01,83.62) 42.93,88.7 42.93,96.01 v1(49.02,102.11)
LED5: length 34.2
  Top Layer w0.254: D1.6 35.17,96.52 v1(37.72,93.98)
  Bottom Layer w0.254: v1(37.72,93.98) 37.72,83.95 40.77,80.9 44.83,80.9 46.74,82.8 v1(46.74,83.62)
LED6: length 48.2
  Top Layer w0.254: v1(39.24,95.12) v1(39.24,105.54)
  Bottom Layer w0.254: v1(45.47,83.62) 45.47,83.06 43.81,81.41 41.15,81.41 39.24,83.31 v1(39.24,95.12) ; D1.8 32.63,112.15 v1(39.24,105.54)
LED7: length 48
  Top Layer w0.254: v1(40.77,97.54) v1(40.77,105.16)
  Bottom Layer w0.254: v1(40.77,105.16) 40.77,117.22 36.32,121.67 31.3,121.67 D1.9 ; v1(44.2,83.62) 40.77,87.05 v1(40.77,97.54)
LED8: length 45.5
  Top Layer w0.254: 45.47,89.1 45.47,98.04 41.91,101.6 v1(41.91,105.16) ; v1(28.07,116.01) 26.92,116.01 D1.12 ; v1(32.05,116.01) 34.86,116.01 v1(41.91,108.97)
  Bottom Layer w0.254: v1(32.05,116.01) v1(28.07,116.01) ; v1(41.91,105.16) v1(41.91,108.97)
P0.0: length 17.7
  Top Layer w0.254: RN3.1 22.48,74.49 23.4,75.41 23.4,75.78 25.15,77.53 25.15,82.14
  Bottom Layer w0.254: 22.47,65.54 22.48,65.55 RN3.1
P0.1: length 17.2
  Top Layer w0.254: RN3.2 26.42,69.72 U34.3
  Bottom Layer w0.254: RN3.2 25.02,67.27 25.01,67.27 U1.38
P0.2: length 17.3
  Top Layer w0.254: RN3.3 27.69,68.45 27.69,74.62 28.48,75.41 28.48,76.49 27.69,77.28 27.69,82.14
  Bottom Layer w0.254: 27.55,65.54 27.55,68.32 RN3.3
P0.3: length 17.1
  Top Layer w0.254: U34.5 28.96,69.47 RN3.4
  Bottom Layer w0.254: RN3.4 30.09,68.32 U1.36
P0.4: length 18.3
  Top Layer w0.254: U34.6 30.23,77.28 31.02,76.49 31.02,75.41 30.23,74.62 30.23,70.74 RN3.5
  Bottom Layer w0.254: RN3.5 32.63,68.32 32.63,65.54
P0.5: length 18.1
  Top Layer w0.254: U34.7 31.5,72.01 RN3.6
  Bottom Layer w0.254: RN3.6 35.17,68.32 35.17,65.54
P0.6: length 18.6
  Top Layer w0.254: RN3.7 33.56,72.49 33.56,76.49 32.77,77.28 32.77,82.14
  Bottom Layer w0.254: U1.33 37.71,68.32 RN3.7
P0.7: length 19.2
  Top Layer w0.254: U34.9 34.04,79.37 36.8,76.61 36.8,71.78 RN3.8
  Bottom Layer w0.254: RN3.8 40.25,68.32 U1.32
P1.0: length 128.9
  Top Layer w0.254: v1(72.37,32.86) 67.64,37.59 22.67,37.59 20.86,39.41 20.86,39.91 19.94,40.83 RN1.16
  Bottom Layer w0.254: v1(72.37,32.86) 81.47,32.86 ; RN1.16 19.94,50.3 U1.1 ; v1(72.37,10.31) 81.47,10.31 ; v1(81.6,24.87) 83.31,26.58 83.31,31.02 v1(81.47,32.86) ; v1(81.6,24.87) 83.31,23.15 83.31,18.8 81.58,17.06 v1(81.47,17.06) 83.19,15.35 83.19,12.02 v1(81.47,10.31) ; v1(81.6,24.87) v1(72.5,24.87) ; v1(72.37,17.06) 81.47,17.06
P1.1: length 110.7
  Top Layer w0.254: v1(23.49,38.25) 23.49,39.68 22.48,40.7 RN1.15 ; v1(55.14,32.73) 50.91,36.96 v1(23.5,36.96)
  Bottom Layer w0.254: v1(64.24,16.94) 66.17,18.87 66.17,22.94 v1(64.36,24.74) ; v1(64.24,16.94) 66.04,15.13 66.04,12.06 64.24,10.26 v1(64.24,10.18) ; v1(64.24,16.94) v1(55.14,16.94) ; 64.2,10.22 63.94,10.22 63.9,10.18 v1(55.14,10.18) ; v1(23.49,38.25) v1(23.49,36.96) ; v1(64.36,24.74) 66.17,26.54 66.17,30.8 v1(64.24,32.73) v1(55.14,32.73) ; v1(64.36,24.74) v1(55.26,24.74) ; RN1.15 22.48,50.3 22.47,50.3
P1.2: length 100.6
  Top Layer w0.254: RN1.14 25.02,40.7 25.94,39.78 v1(25.94,38.25) ; U13.2 43.61,36.37 v1(25.94,36.37)
  Bottom Layer w0.254: v1(38.16,24.87) 47.26,24.87 ; RN1.14 25.02,50.3 U1.3 ; v1(38.03,32.86) 46.91,32.86 v1(47.13,32.64) 49.15,30.62 49.15,26.76 v1(47.26,24.87) 49.15,22.97 49.15,19.29 v1(47.13,17.27) ; v1(47.13,17.27) 46.92,17.06 v1(38.03,17.06) ; v1(47.13,17.27) 49.15,15.25 49.15,12.33 v1(47.13,10.31) ; v1(38.03,10.31) U25.2 ; v1(25.94,38.25) 25.94,36.58
P1.3: length 81.7
  Top Layer w0.254: v1(28.58,35.79) 28.58,33.29 v1(29.26,32.6) ; v1(28.53,38.24) 28.53,39.73 27.56,40.7 RN1.13
  Bottom Layer w0.254: RN1.13 27.56,50.3 27.55,50.3 ; v1(29.39,24.61) 30.99,23.01 30.99,18.54 v1(29.26,16.81) 31.24,14.83 31.24,12.04 v1(29.26,10.06) ; v1(29.39,24.61) 31.11,26.34 31.11,30.75 v1(29.26,32.6) ; v1(29.39,24.61) v1(20.29,24.61) ; v1(20.16,10.06) 29.26,10.06 ; 28.58,35.94 28.58,38.19 v1(28.53,38.24) ; v1(20.16,16.81) 29.26,16.81 ; v1(20.16,32.6) 29.26,32.6
P1.4: length 108.5
  Top Layer w0.254: v1(29.26,5.56) 37.78,5.56 v1(38.03,5.81) ; v1(31.02,38.28) 31.02,40.04 30.1,40.95 RN1.12 ; v1(47.13,5.81) 55.01,5.81 v1(55.14,5.68) ; v1(72.37,5.81) 72.24,5.68 v1(64.24,5.68)
  Bottom Layer w0.254: v1(55.14,5.68) v1(64.24,5.68) ; v1(20.16,5.56) v1(29.26,5.56) 32.39,8.68 32.39,36.92 v1(31.02,38.28) ; v1(38.03,5.81) v1(47.13,5.81) ; v1(72.37,5.81) v1(81.47,5.81) ; U1.5 30.1,50.3 RN1.12
P1.5: length 101.5
  Top Layer w0.254: v1(64.24,12.44) 72.24,12.44 v1(72.37,12.56) ; v1(29.26,12.31) 37.78,12.31 v1(38.03,12.56) ; v1(55.14,12.44) 55.01,12.56 v1(47.13,12.56) ; v1(33.66,38.23) 33.66,39.68 32.64,40.7 RN1.11
  Bottom Layer w0.254: RN1.11 32.64,50.3 32.63,50.3 ; v1(20.16,12.31) v1(29.26,12.31) ; v1(47.13,12.56) v1(38.03,12.56) 33.66,16.94 v1(33.66,38.23) ; v1(72.37,12.56) v1(81.47,12.56) ; v1(55.14,12.44) v1(64.24,12.44)
P1.6: length 93.7
  Top Layer w0.254: v1(47.26,20.37) 55.14,20.37 v1(55.26,20.24) ; RN1.10 35.18,40.7 36.1,39.78 v1(36.1,38.25) ; v1(38.16,20.37) 37.9,20.11 v1(29.39,20.11) ; v1(64.36,20.24) 72.37,20.24 v1(72.5,20.37)
  Bottom Layer w0.254: v1(72.5,20.37) v1(81.6,20.37) ; v1(47.26,20.37) v1(38.16,20.37) 34.93,23.6 34.93,37.08 v1(36.1,38.25) ; RN1.10 35.18,48.19 35.17,48.2 35.17,50.3 ; v1(20.29,20.11) v1(29.39,20.11) ; v1(55.26,20.24) v1(64.36,20.24)
P1.7: length 85.8
  Top Layer w0.254: v1(38.64,38.25) 38.64,39.78 37.72,40.7 RN1.9 ; v1(29.26,28.1) 37.78,28.1 v1(38.03,28.36) ; v1(72.37,28.36) 72.24,28.23 v1(64.24,28.23) ; v1(55.14,28.23) 55.01,28.36 v1(47.13,28.36)
  Bottom Layer w0.254: U1.8 37.71,49.25 37.72,49.24 RN1.9 ; v1(38.64,38.25) 35.94,35.56 35.94,30.45 v1(38.03,28.36) v1(47.13,28.36) ; v1(20.16,28.1) v1(29.26,28.1) ; v1(55.14,28.23) v1(64.24,28.23) ; v1(72.37,28.36) v1(81.47,28.36)
P2.0: length 2.7
  Bottom Layer w0.254: RN4.8 68.2,66.6 68.19,66.6 U1.21
P2.1: length 2.7
  Bottom Layer w0.254: U1.22 65.65,67.65 65.66,67.65 RN4.7
P2.2: length 30.1
  Top Layer w0.254: v1(58.04,73.28) 57.02,74.29 55.57,74.29 54.58,75.28 54.58,75.65 51.24,79 51.24,85.02 53.09,86.87 53.09,89.1
  Bottom Layer w0.254: U1.23 63.12,65.55 RN4.6 v1(58.04,73.28)
P2.3: length 30
  Top Layer w0.254: v1(56.39,72.36) 54.38,72.36 51.82,74.93 51.82,76.38 49.91,78.29 49.91,84.58 51.82,86.49 U29.2
  Bottom Layer w0.254: 60.57,65.54 60.58,65.55 RN4.5 56.41,72.36 v1(56.39,72.36)
P2.4: length 28.2
  Top Layer w0.254: v1(54.99,71.25) 51.34,74.9 51.34,76.36 48.69,79 48.69,83.87 48.7,83.87 48.7,84.55 50.55,86.4 U29.3
  Bottom Layer w0.254: U1.25 58.04,65.55 RN4.4 v1(54.99,71.25)
P2.5: length 2.7
  Bottom Layer w0.254: RN4.3 55.5,65.55 U1.26
P2.6: length 2.7
  Bottom Layer w0.254: RN4.2 52.96,65.55 U1.27
P2.7: length 2.7
  Bottom Layer w0.254: RN4.1 50.42,65.55 U1.28
P3.2: length 3.3
  Bottom Layer w0.254: U1.12 47.87,48.05 47.88,48.04 RN2.14
P3.3: length 3.3
  Bottom Layer w0.254: U1.13 50.41,49.1 50.42,49.09 RN2.13
P3.4: length 3.3
  Bottom Layer w0.254: U1.14 52.95,46.99 RN2.12
P3.5: length 3.3
  Bottom Layer w0.254: U1.15 55.49,46.99 RN2.11
P3.6: length 3.3
  Bottom Layer w0.254: RN2.10 58.03,46.99 U1.16
P3.7: length 3.3
  Bottom Layer w0.254: 60.57,50.3 60.57,46.99 RN2.9
RST: length 64.1
  Top Layer w0.254: SW1.3 SW1.4 68.04,85.31 66.42,83.69 C1.2 61.85,79.16 61.85,75.63 59.5,73.28 59.12,73.28 53.88,68.03 53.88,67.66 53.34,67.12 52.98,67.12 51.49,65.64 51.49,65.09 40.25,53.86 U1.9 40.28,50.28 R1.1
XTAL1: length 15.5
  Top Layer w0.254: X1.1 67.58,41.37 U2.2 63.11,45.84 U1.18
XTAL2: length 9.6
  Top Layer w0.254: X1.2 71.94,46.58 U3.1 65.79,47.97 65.79,50.17 U1.19
$1N691: length 13.9
  Top Layer w0.254: R2.1 42.94,65.69 42.79,65.54
$1N1499: length 6.9
  Top Layer w0.254: U34.18 26.42,92.46 25.02,93.85 25.02,95.03 RN5.1
$1N1500: length 13.6
  Top Layer w0.254: RN5.2 27.56,97.37 27.33,97.61 26.8,97.61 24.57,95.38 24.57,90.48 24.91,90.14 27.04,90.14 27.81,90.91 27.81,91.6
$1N1501: length 12.5
  Top Layer w0.254: U34.16 28.96,91.17 29.99,90.14 30.47,90.14 30.8,90.48 30.8,95.67 28.5,97.97 28.25,97.97 28.07,97.79 28.07,97.08 RN5.3
$1N1502: length 6.2
  Top Layer w0.254: U34.15 30.23,95.41 RN5.4
$1N1503: length 6
  Top Layer w0.254: U34.14 31.5,96.3 RN6.1
$1N1504: length 11.8
  Top Layer w0.254: RN6.2 32.9,98.04 v1(32.26,98.68)
  Bottom Layer w0.254: 32.19,98.74 31.5,99.44 30.73,99.44 30.35,99.06 30.35,98.3 32.77,95.88 v1(32.77,92.33)
$1N1505: length 11.5
  Top Layer w0.254: v1(34.09,98.78) 34.09,98.73 33.4,98.04 RN6.3
  Bottom Layer w0.254: 34.23,98.87 34.8,99.44 35.56,99.44 35.94,99.06 35.94,98.04 34.04,96.14 34.04,92.38 v1(34.09,92.33)
$1N1506: length 6.2
  Top Layer w0.254: 35.31,91.6 35.31,95.79 RN6.4
$1N1507: length 80.1
  Top Layer w0.254: v1(26.54,95.5) 26.8,95.5 27.06,95.77 RN5.8 ; D2.11 73.57,123.06 27.61,123.06 D1.11
  Bottom Layer w0.254: v1(26.54,95.5) 26.29,95.5 26.07,95.72 26.07,119.41 D1.11
$1N1508: length 91.7
  Top Layer w0.254: 35.24,120.4 34.06,120.4 28.6,114.93 25.15,114.93 v1(24,113.79) ; 35.24,120.4 D1.7 ; 35.24,120.4 38.54,117.09 82.96,117.09 D2.7 ; RN5.7 27.56,94.62 v1(26.8,93.85)
  Bottom Layer w0.254: v1(24,113.79) 24,105.7 23.96,105.66 23.96,96.69 v1(26.8,93.85)
$1N1509: length 77.1
  Top Layer w0.254: D1.4 29.04,105.22 28.19,104.37 28.19,101.25 25.62,98.68 22.99,98.68 v1(22.1,97.79) ; v1(78.87,103.12) 80.97,105.22 81.25,105.22 ; RN5.6 28.07,96.22 v1(28.07,93.98)
  Bottom Layer w0.254: v1(78.87,103.12) 32.89,103.12 30.79,105.22 D1.4 ; v1(28.07,93.98) 27.18,93.09 25.53,93.09 22.1,96.52 v1(22.1,97.79)
$1N1510: length 67.5
  Top Layer w0.254: RN5.5 28.56,95.08 v1(28.65,95) ; D1.2 25.01,105.23 26.85,107.06 v1(74.16,107.06)
  Bottom Layer w0.254: D2.2 74.33,107.06 v1(74.16,107.06) ; v1(28.65,95) 28.22,94.56 26.66,94.56 25.01,96.21 D1.2
$1N1511: length 69.5
  Top Layer w0.254: RN6.8 32.4,95.57 v1(32.08,95.25) ; v1(70.97,107.64) 24.94,107.64 24.89,107.7 24.89,107.64 D1.1 22.47,103.76 25.27,100.96 v1(27.08,100.96)
  Bottom Layer w0.254: v1(32.08,95.25) 32.08,95.99 27.11,100.96 v1(27.08,100.96) ; D2.1 73.4,105.22 v1(70.97,107.64)
$1N1512: length 84.7
  Top Layer w0.254: RN6.7 32.9,94.75 32.39,94.23 v1(32.13,94.23)
  Bottom Layer w0.254: D2.10 76.74,122.43 29.52,122.43 D1.10 26.5,119.41 26.5,99.23 31.5,94.23 v1(32.13,94.23)
$1N1513: length 70
  Top Layer w0.254: v1(34.62,94.23) 33.4,95.45 33.4,96.34 RN6.6 ; v1(43.43,101.47) v1(45.72,103.76)
  Bottom Layer w0.254: D2.5 82.32,103.76 v1(45.72,103.76) 34.1,103.76 D1.5 ; v1(43.43,101.47) 36.19,94.23 v1(34.62,94.23)
$1N1514: length 71.8
  Top Layer w0.254: RN6.5 33.91,96.33 33.91,96.01 v1(34.67,95.25) ; D1.3 28.76,106.43 v1(77.47,106.43)
  Bottom Layer w0.254: v1(77.47,106.43) 78.67,105.22 D2.3 ; D1.3 31.94,100.84 36.32,100.84 36.96,100.2 36.96,96.14 36.07,95.25 v1(34.67,95.25)

## Copper pours and planes (outline as drawn; the poured copper is in the pictures)
GND on Top Layer: 0,124.59 107.31,124.59 107.31,0 0,0
GND on Bottom Layer: 0,124.46 107.19,124.46 107.19,0 0,0

## Text on the board
Top Silkscreen Layer: VCC
